# EAGLE design isp (EAGLE 6.3)
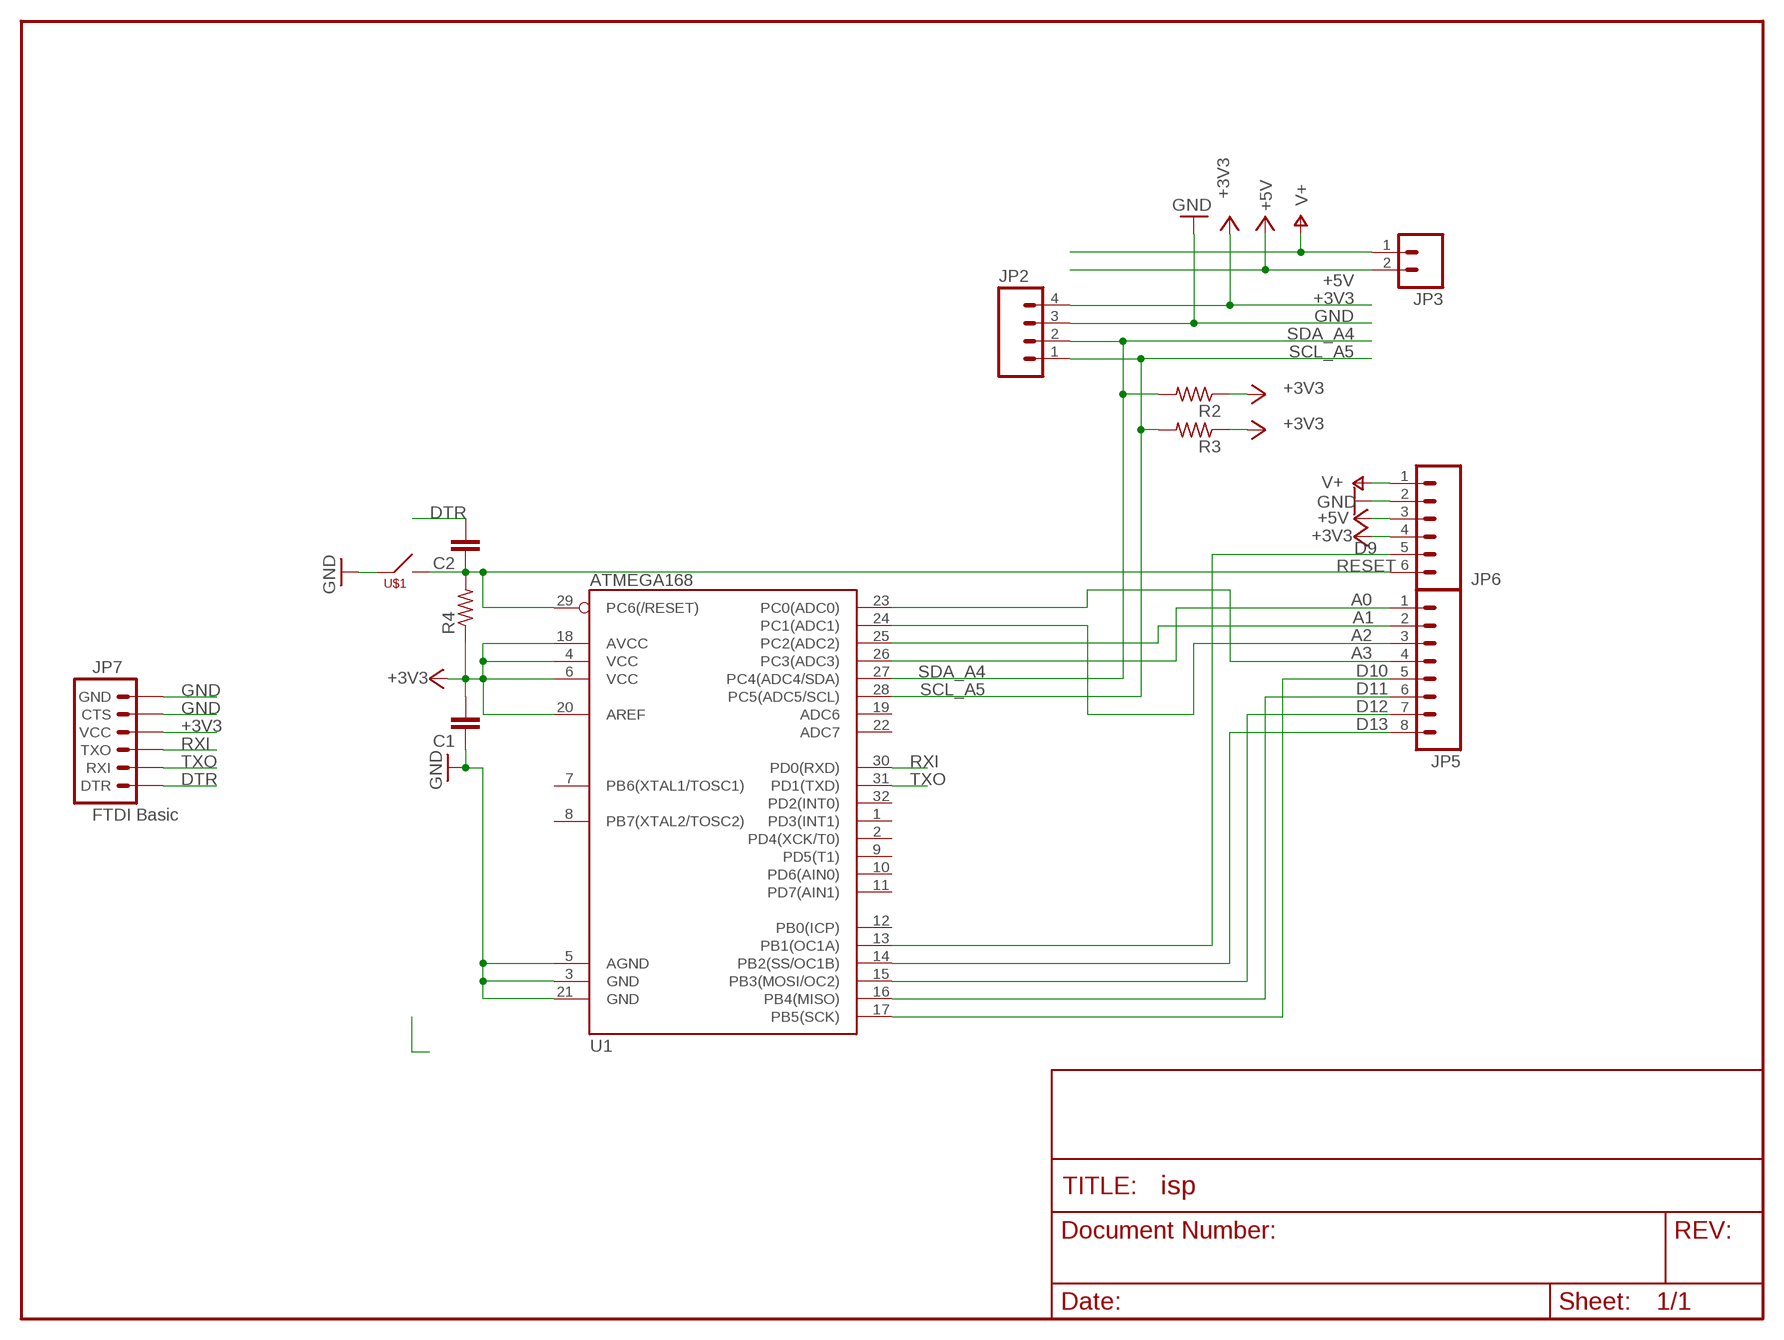
[diagram p0: schematic, sheet 1]

## Parts
C1  CAPKIT  [CAP-PTH-SMALL-KIT]
C2  CAPKIT  [CAP-PTH-SMALL-KIT]
JP2  M04PTH  [1X04]
JP3  M02PTH  [1X02]
JP5  M081X08  [1X08]
JP6  M06SIP  [1X06]
JP7  FTDI Basic  ARDUINO_SERIAL_PROGRAMPTH  [1X06]
R2  R-US_0204/2V  [0204V]
R3  R-US_0204/2V  [0204V]
R4  R-US_0204/2V  [0204V]
U1  ATMEGA168  [TQFP32-08]
U$1  PTS635_SWITCH  [PTS635_SWITCH]

## Nets
+3V3: C1.2 JP2.4 JP6.4 JP7.4(VCC) R2.1 R3.1 R4.1 U1.4(VCC) U1.6(VCC) U1.18(AVCC) U1.20(AREF)
+5V: JP3.2 JP6.3
A0: JP5.4 U1.23(PC0(ADC0))
A1: JP5.3 U1.24(PC1(ADC1))
A2: JP5.2 U1.25(PC2(ADC2))
A3: JP5.1 U1.26(PC3(ADC3))
D9: JP6.5 U1.13(PB1(OC1A))
D10: JP5.8 U1.14(PB2(SS/OC1B))
D11: JP5.7 U1.15(PB3(MOSI/OC2))
D12: JP5.6 U1.16(PB4(MISO))
D13: JP5.5 U1.17(PB5(SCK))
DTR: C2.2 JP7.1(DTR)
GND: C1.1 JP2.3 JP6.2 JP7.5(CTS) JP7.6(GND) U1.3(GND) U1.5(AGND) U1.21(GND) U$1.P$1
RESET: C2.1 JP6.6 R4.2 U1.29(PC6(/RESET)) U$1.P$2
RXI: JP7.3(TXO) U1.30(PD0(RXD))
SCL_A5: JP2.1 R3.2 U1.28(PC5(ADC5/SCL))
SDA_A4: JP2.2 R2.2 U1.27(PC4(ADC4/SDA))
TXO: JP7.2(RXI) U1.31(PD1(TXD))
V+: JP3.1 JP6.1
Unconnected: U1.1(PD3(INT1)) U1.2(PD4(XCK/T0)) U1.7(PB6(XTAL1/TOSC1)) U1.8(PB7(XTAL2/TOSC2)) U1.9(PD5(T1)) U1.10(PD6(AIN0)) U1.11(PD7(AIN1)) U1.12(PB0(ICP)) U1.19(ADC6) U1.22(ADC7) U1.32(PD2(INT0))

## Library data of the parts
C1 C2 = SparkFun:CAP: Capacitor Standard 0603 ceramic capacitor, and 0.1" leaded capacitor.
JP2 = SparkFun_mod:M04: Header 4 Standard 4-pin 0.1" header. Use with straight break away headers (SKU : PRT-00116), right angle break away headers (PRT-00553), swiss pins (PRT-00743), machine pins (PRT-00117), and female headers (PRT-00115). Molex polarized connector foot print use with SKU : PRT-08231 with associated crimp pins and housings. 1MM SMD Version SKU: PRT-10208
JP3 = SparkFun_mod:M02: Header 2 Standard 2-pin 0.1" header. Use with straight break away headers (SKU : PRT-00116), right angle break away headers (PRT-00553), swiss pins (PRT-00743), machine pins (PRT-00117), and female headers (PRT-00115). Molex polarized connector foot print use with SKU : PRT-08233 with associated crimp pins and housings.
JP5 = SparkFun_mod:M08: Header 8 Standard 8-pin 0.1" header. Use with straight break away headers (SKU : PRT-00116), right angle break away headers (PRT-00553), swiss pins (PRT-00743), machine pins (PRT-00117), and female headers (PRT-00115).
JP6 = SparkFun:M06: Header 6 Standard 6-pin 0.1" header. Use with straight break away headers (SKU : PRT-00116), right angle break away headers (PRT-00553), swiss pins (PRT-00743), machine pins (PRT-00117), and female headers (PRT-00115). Molex polarized connector foot print use with SKU : PRT-08094 with associated crimp pins and housings. NOTES ON THE VARIANTS LOCK and LOCK_LONGPADS... This footprint was designed to help hold the alignment of a through-hole component (i.e. 6-pin header) while soldering it into place. You may notice that each hole has been shifted either up or down by 0.005 of an inch from it's more standard position (which is a perfectly straight line). This slight alteration caused the pins (the squares in the middle) to touch the edges of the holes. Because they are alternating, it causes a "brace" to hold the component in place. 0.005 has proven to be the perfect amount of "off-center" position when using our standard breakaway headers. Although looks a little odd when you look at the bare footprint, once you have a header in there, the alteration is very hard to notice. Also, if you push a header all the way into place, it is covered up entirely on the bottom side. This idea of altering the position of holes to aid alignment will be further integrated into the Sparkfun Library for other footprints. It can help hold any component with 3 or more connection pins.
JP7 = SparkFun:ARDUINO_SERIAL_PROGRAM
R2-R4 = adafruit_mod:R-US_: RESISTOR, American symbol
U1 = SparkFun:ATMEGA168
U$1 = _my-parts:PTS635_SWITCH: www.ck-components.com

## Net classes
0 default: width 0.203 mm
1 vcc: width 0.254 mm

## Board
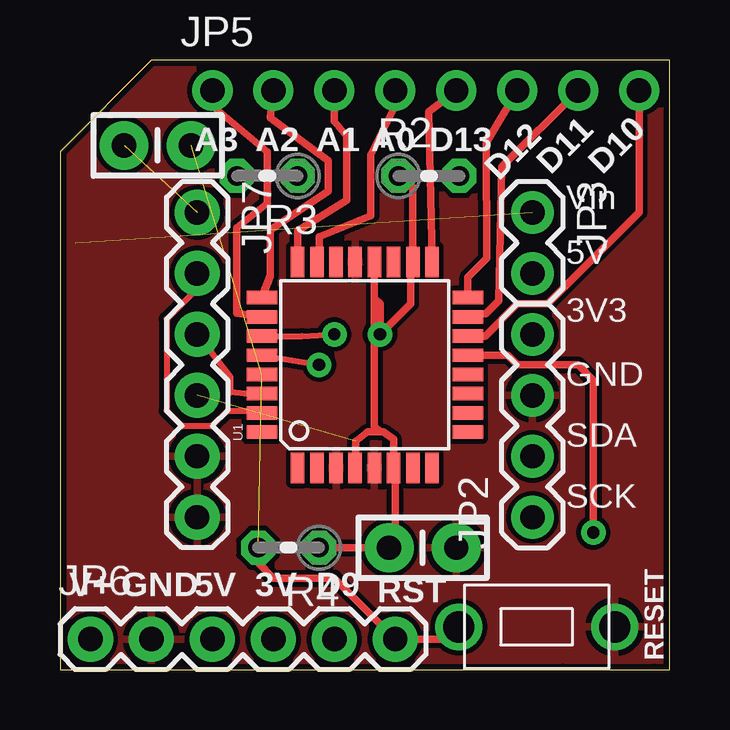
[diagram p1: board, top side]
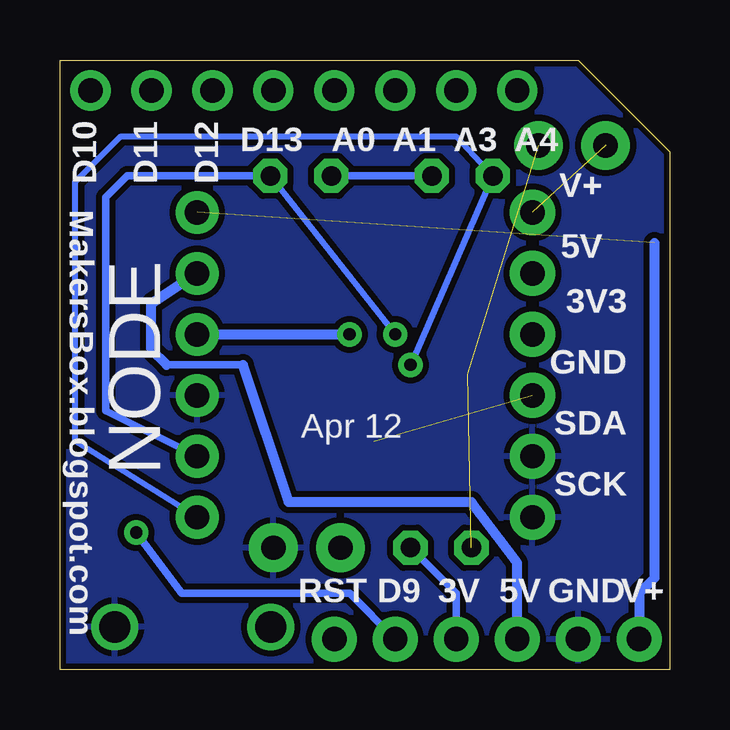
[diagram p2: board, bottom side, seen from below]

Size 25.4 x 25.4 mm. Coordinates in mm from the lower left corner, seen from the top.
Outline: 25.4,25.4 25.4,21.59 25.4,0 24.77,0 20.96,0 0,0 0,21.59
Outline: 25.4,25.4 3.81,25.4 0,21.59
Outline: 0,21.59 0,21.59
Copper layers (1*16): Top 0.035mm / dielectric 1.5mm / Bottom 0.035mm
Design rules "SparkFun": minimum track width 8mil, minimum drill 20mil, track to track 8mil, track to pad 8mil, pad to pad 8mil, via to via 8mil, smd to smd 8mil, copper to edge 10mil, drill to drill 8mil, minimum pad ring 12mil, minimum via ring 10mil, stop-mask expansion 4mil, vias tented up to drill 25mil, thermal gap 10mil

### Footprints (pad centres in the part's own frame; a part is rotated, then mirrored left to right if it is on the bottom)
CAP-PTH-SMALL-KIT = drill 1.016 pad 2.032: 1 -1.397,0; 2 1.397,0
1X04 = drill 1.016 pad 1.778: 1 0,0; 2 2.54,0; 3 5.08,0; 4 7.62,0
1X02 = drill 1.016 pad 1.778: 1 0,0; 2 2.54,0
1X08 = drill 1.016 pad 1.676: 1 0,0; 2 2.54,0; 3 5.08,0; 4 7.62,0; 5 10.16,0; 6 12.7,0; 7 15.24,0; 8 17.78,0
1X06 = drill 1.016 pad 1.88: 1 0,0; 2 2.54,0; 3 5.08,0; 4 7.62,0; 5 10.16,0; 6 12.7,0
0204V = drill 0.813 octagon: 1 -1.27,0; 2 1.27,0
TQFP32-08 = smd 1.27 x 0.559: 1 -4.293,2.8; 2 -4.293,2; 3 -4.293,1.2; 4 -4.293,0.4; 5 -4.293,-0.4; 6 -4.293,-1.2; 7 -4.293,-2; 8 -4.293,-2.8; 17 4.293,-2.8; 18 4.293,-2; 19 4.293,-1.2; 20 4.293,-0.4; 21 4.293,0.4; 22 4.293,1.2; 23 4.293,2; 24 4.293,2.8 | smd 0.559 x 1.27: 9 -2.8,-4.293; 10 -2,-4.293; 11 -1.2,-4.293; 12 -0.4,-4.293; 13 0.4,-4.293; 14 1.2,-4.293; 15 2,-4.293; 16 2.8,-4.293; 25 2.8,4.293; 26 2,4.293; 27 1.2,4.293; 28 0.4,4.293; 29 -0.4,4.293; 30 -1.2,4.293; 31 -2,4.293; 32 -2.8,4.293
PTS635_SWITCH = drill 1.3: P$1 0,0; P$2 6.5,0

### Placement (x,y rotation side)
C1  15.11,5.08 180 top
C2  4.06,21.84 180 top
JP2  19.68,6.35 90 top
JP3  19.68,19.05 270 top
JP5  6.35,24.13 0 top
JP6  1.27,1.27 0 top
JP7  5.71,19.05 270 top
R2  15.37,20.57 0 top
R3  8.64,20.57 180 top
R4  9.53,5.08 180 top
U1  12.7,12.7 90 top
U$1  23.11,1.78 180 top

### Tracks (layer width: path | path; a pad name or v marks a point on that pad's centre or on a via)
+3V3  (via drill 0.51)  (1 unrouted)
  Top 0.305: 13.34,9.91 13.46,9.91 13.9,9.6 U1.6 13.97,8.34 13.97,5.71 13.72,5.46 C1.2 R4.1 | 13.34,9.91 12.83,9.91 12.32,9.53 12.32,8.64 U1.4 | 13.1,15.47 13.34,15.24 v13.34,13.97 14.61,15.24 14.61,16.9 U1.18 14.7,20.1 R2.1 | U1.20 13.1,15.47 | 13.1,15.47 13.1,10.14 13.34,9.91
  Bottom 0.305: JP6.4 8.89,3.17 R4.1 | R2.1 R3.1
  Bottom 0.406: JP2.4 v13.34,13.97
+5V
  Bottom 0.305: 17.78,12.7 20.95,12.7
  Bottom 0.406: JP6.3 6.35,4.45 8.26,6.99 15.88,6.99 17.78,12.7 | 20.95,12.7 21.59,13.34 21.59,15.24 JP3.2
A0
  Top 0.305: JP5.4 13.97,23.5 12.95,21.46 12.95,18.92 10.79,18.03 10.79,17.09 U1.23
A1
  Top 0.305: JP5.3 11.43,22.86 11.94,22.23 11.94,19.56 9.91,18.29 9.91,17.13 U1.24
A2
  Top 0.305: JP5.2 8.76,22.99 11.18,21.21 11.18,19.94 8.89,18.41 8.76,18.29 8.76,16.41 U1.25
A3
  Top 0.305: JP5.1 6.35,23.5 8.64,21.59 8.64,19.43 7.37,18.41 7.37,14.85 U1.26
D9  (via drill 0.51)
  Top 0.305: U1.13 18.65,13.1 19.05,12.7 21.59,12.7 22.23,12.06 v22.23,5.71
  Bottom 0.305: JP6.5 13.34,3.17 20.32,3.17 v22.23,5.71
D10
  Top 0.305: U1.14 17.71,13.9 19.05,15.24 20.32,15.24 24.13,19.05 JP5.8
D11
  Top 0.305: U1.15 17.75,14.83 18.29,15.37 18.41,20.95 JP5.7
D12
  Top 0.305: U1.16 16.99,16.36 17.78,17.14 17.75,21.95 JP5.6
D13
  Top 0.305: U1.17 15.37,23.25 JP5.5
DTR  (1 unrouted)
GND
  pour Bottom (isolate 0.254): -1.27,26.67 26.67,26.67 26.67,-1.27 -1.27,-1.27
  pour Top: -0.64,26.04 26.67,26.04 26.67,0 26.04,-0.64 -0.64,-0.64
RESET  (2 unrouted)
  Top 0.305: R4.2 8.26,4.45 8.89,3.81 11.43,3.81 JP6.6 16.11,1.27 U$1.P$2
RXI
  Top 0.254: U1.30 7.69,11.5 7.11,11.56 7.11,12.19 JP7.3
SCL_A5  (via drill 0.51)
  Top 0.254: U1.28 v10.79,12.7
  Bottom 0.254: JP2.1 24.77,9.53 24.77,20.32 22.86,22.23 8.89,22.23 R3.2 v10.79,12.7
SDA_A4  (via drill 0.51)
  Top 0.254: U1.27 10.09,13.9 v11.43,13.97
  Bottom 0.254: R2.2 v11.43,13.97
  Bottom 0.305: R2.2 22.61,20.57 23.5,19.68 23.5,10.79 JP2.2
TXO
  Top 0.254: JP7.2 5.71,15.88 4.45,14.61 4.45,10.79 5.08,10.16 6.35,10.16 6.99,10.79 8.31,10.79 U1.31
V+  (1 unrouted)
  Bottom 0.406: 0.64,17.78 0.64,3.81 1.27,3.17 JP6.1

### Text on the board
tPlace: NODE | A3 | A2 | A1 | A0 | D13 | D11 | D10 | D12 | Vin | 5V | 3V3 | GND | SDA | SCK | V+ | GND | 5V | 3V | D9 | RST | RESET
bPlace: D12 | D11 | D10 | A4 | A3 | A1 | A0 | D13 | V+ | MakersBox.blogspot.com | 5V | 3V3 | GND | SDA | Apr 12 | SCK | NODE | V+ | GND | 5V | 3V | D9 | RST